# Altium schematic sheet balancingBridge.SchDoc
size A4; SheetNumber: 2; SheetTotal: 7
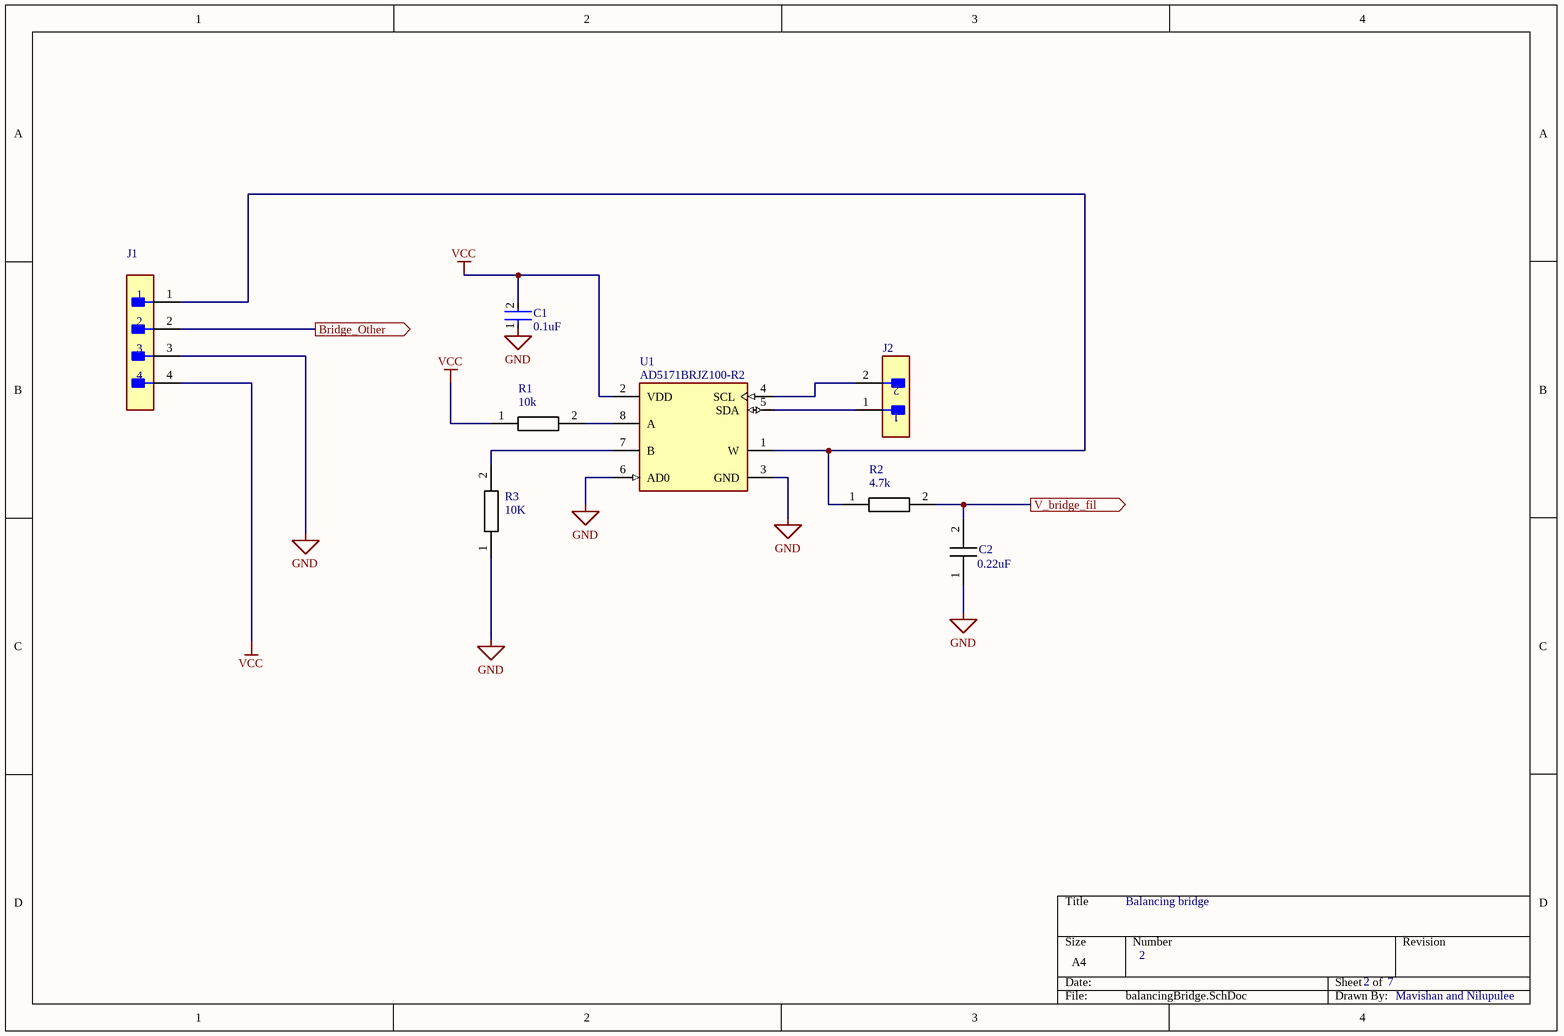
[diagram p0: balancingBridge.SchDoc]

## Parts
C1  0.1uF  [FP-C1206C-EB-MFG]
C2  Parameter 1: 0.22uF  [CAPC3216X94N]  (hidden comment: 12063C224JAT2A)
J1  B4B-XH-A(LF)(SN)  [FP-B4B-XH-A_LF_SN-MFG]  (value not drawn)
J2  M20-9990246  [FP-M20-9990246-MFG]  (value not drawn)
R1  Parameter 1: 10k  [RESC3216X70N]  (hidden comment: ERA-8AEB103V)
R2  Parameter 1: 4.7k  [RESC3116X65N]  (hidden comment: CHP1206AFX-4701ELF)
R3  Parameter 1: 10K  [RESC3216X70N]  (hidden comment: ERA-8AEB103V)
U1  AD5171BRJZ100-R2  [FP-RJ-8-IPC_A]

## Ports
Bridge_Other (out, see Main PCB[2B]), V_bridge_fil (out, see Main PCB[2B])

## Nets
GND: C1.1 C2.1(C1) J1.3 R3.1 U1.3(GND) U1.6(AD0)
VCC: C1.2 J1.4 R1.1 U1.2(VDD)
Bridge_Other: J1.2 ; port Bridge_Other
V_bridge_fil: C2.2(C2) R2.2 ; port V_bridge_fil
NetJ1_1: J1.1 R2.1 U1.1(W)
NetJ2_1: J2.1 U1.5(SDA)
NetJ2_2: J2.2 U1.4(SCL)
NetR1_2: R1.2 U1.8(A)
NetR3_2: R3.2 U1.7(B)

## Notes on the sheet
- Balancing bridge
- 2
- 7
- Mavishan and Nilupulee

## Library data of the parts
C1 = CMP-1037-04186-2: CAP CER 0.1UF 25V C0G/NP0 1206; Manufacturer: KEMET; Manufacturer Part Number: C1206C104F3GACTU; Material: Ceramic; Value: 0.10 μF; Temperature Characteristic: C0G; Temperature Coefficient: 15%; Tolerance: 0.01; Automotive Grade: Grade 0; Device Class L3: Ceramic Capacitors; Voltage Rating: 25 V; Temperature Range Low: -55°C; RoHS: TRUE; Package: C1206C-EB; Category: Cap; Lead Free: Yes; ComponentLink2URL: https://content.kemet.com/datasheets/KEM_C1007_X8R_ULTRA_150C_SMD.pdf; Ipc Land Pattern Name: CAPC320160X78; Temperature Range High: +150°C; Height: 0.88mm; Digikey Description: CAP CER 0.1UF 25V C0G/NP0 1206; ComponentLink2Description: Datasheet; Capacitance: 0.10 μF; Mouser Description: Multilayer Ceramic Capacitors MLCC - SMD/SMT 25volts 0.1uF 1% C0G; Octopart: https://octopart.com/c1206c104f3gactu-kemet-13149870; Device Class L1: Passive Components; Device Class L2: Capacitors; Automotive: Yes; Temperature: -55°C to +150°C
C2 = 12063C224JAT2A: Capacitor; Manufacturer_Name: Kyocera AVX; Manufacturer_Part_Number: 12063C224JAT2A; Mouser Part Number: 581-12063C224JAT2A; Arrow Part Number: 12063C224JAT2A; Arrow Price/Stock: https://www.arrow.com/en/products/12063c224jat2a/avx
J1 = CMP-17439-000250-1: CONN HEADER VERT 4POS 2.5MM; Number of Contacts: 4; Contact Resistance: 20mR; Voltage Rating: 250V; Max Current Rating: 3A; Gender: Male; Wire/Cable Gauge: 22AWG; Mated Stacking Heights: 9.8mm; Insulation Resistance: 1GR; Orientation: Straight; Contact Type: Male Pin; Contact Finish - Mating: TIN; Series: XH; Max Voltage Rating (AC): 250V; Lead Pitch: 2.5mm; Contact Shape: Square; Insulation Color: Natural; Termination: Solder; Lead Free: Lead Free; Voltage Rating (AC): 250V; Number of Rows: 1; Flammability Rating: UL94 V-0; Number of Positions: 4; Max Operating Temperature: 85°C; Package Quantity: 500; Mount: Through Hole; REACH SVHC: No SVHC; Connector Type: Header; Insulation Material: Nylon; Fastening Type: Detent; Min Operating Temperature: -25°C; Housing Color: White; Packaging: Bulk; Contact Plating: Tin; Contact Material: Brass; Max Voltage Rating (DC): 250V; Housing Material: Polyamide; Color: Natural; Material: Polyamide; Pitch: 2.5mm; Depth: 5.75mm; Current Rating: 3A; Length: 12.4mm
J2 = CMP-15831-000009-1: CONN HEADER VERT 2POS 2.54MM; Manufacturer: Harwin; Conn Gender: Male; Conn Orientation: Vertical; Number Of Contacts: 2; Current Rating: 3A; ComponentLink2URL: https://cdn.harwin.com/pdfs/M20-999.pdf; ComponentLink2Description: Datasheet; Package: M20-9990246; Temperature: -40°C to +105°C; Octopart: https://octopart.com/m20-9990246-harwin-2590635; Mouser Description: 2.54mm (0.1") Pitch SIL Vertical PC Tail Pin Header, 6.1mm mating pin height, tin, 2 contacts; Temperature Range High: +105°C; Device Class L1: Connectors; RoHS: TRUE; Automotive: No; Height: 8.99mm; Number Of Rows: 1; Contact Material: Tin,Nickel; Category: Conn; Pitch: 2.54mm; Lead Free: Yes; Digikey Description: CONN HEADER VERT 2POS 2.54MM; Manufacturer Part Number: M20-9990246; Temperature Range Low: -40°C; Device Class L3: unset; Device Class L2: Headers and Wire Housings
R1 R3 = ERA-8AEB103V: Resistor; Manufacturer_Name: Panasonic; Datasheet Link: https://industrial.panasonic.com/cdbs/www-data/pdf/RDM0000/AOA0000C307.pdf; Height: 0.7mm; Manufacturer_Part_Number: ERA-8AEB103V; Mouser Part Number: 667-ERA-8AEB103V; Mouser Price/Stock: https://www.mouser.co.uk/ProductDetail/Panasonic/ERA-8AEB103V?qs=Ojoo2rCVP9QscDrGu5R0Gw%3D%3D; Arrow Part Number: ERA-8AEB103V; Arrow Price/Stock: https://www.arrow.com/en/products/era8aeb103v/panasonic?region=europe
R2 = CHP1206AFX-4701ELF: Resistor; Manufacturer_Name: Bourns; Datasheet Link: https://www.mouser.be/datasheet/2/54/chp-a-1858677.pdf; Height: 0.65mm; Manufacturer_Part_Number: CHP1206AFX-4701ELF; Mouser Part Number: 652-CHP1206AFX-4701L; Mouser Price/Stock: https://www.mouser.co.uk/ProductDetail/Bourns/CHP1206AFX-4701ELF?qs=GedFDFLaBXHtzjpWW2eupA%3D%3D
U1 = CMP-00026-00446399-1: AD5171BRJZ100-R2 Digital Potentiometer 64POS 100kOhm Single Automotive 8-Pin SOT-23 T/R; Manufacturer Lifecycle Status: PRODUCTION; NexarPartId: 446399; -3db Bandwidth: 1.5MHz; Operating Supply Current: 4µA; Temperature Coefficient: 35ppm/°C; Number of Circuits: 1; Tolerance: 30%; Number of Taps: 64; Max Supply Voltage: 5.5V; Interface: I2C; Resistance: 100kΩ; Frequency: 400kHz; Max Junction Temperature (Tj): 150°C; Min Supply Voltage: 2.7V; Memory Type: Non-Volatile, Volatile; Width: 1.6mm; Lead Free: Contains Lead; Case/Package: SOT-23; Quiescent Current: 4µA; RoHS: Compliant; Taper: Linear; Min Operating Temperature: -40°C; Length: 2.9mm; Height: 1.3mm; Lifecycle Status: Production; Packaging: Cut Tape; Number of Pins: 8; REACH SVHC: No SVHC; Contact Plating: Gold; Nominal Supply Current: 4µA; Max Operating Temperature: 125°C; Number of Elements: 1; Mount: Surface Mount; Max Supply Current: 4µA; Schedule B: 8542390000, 8542390000; Number of Positions: 64; Operating Supply Voltage: 5.5V